# Altium schematic sheet NRF24L01P.SchDoc
size Tabloid
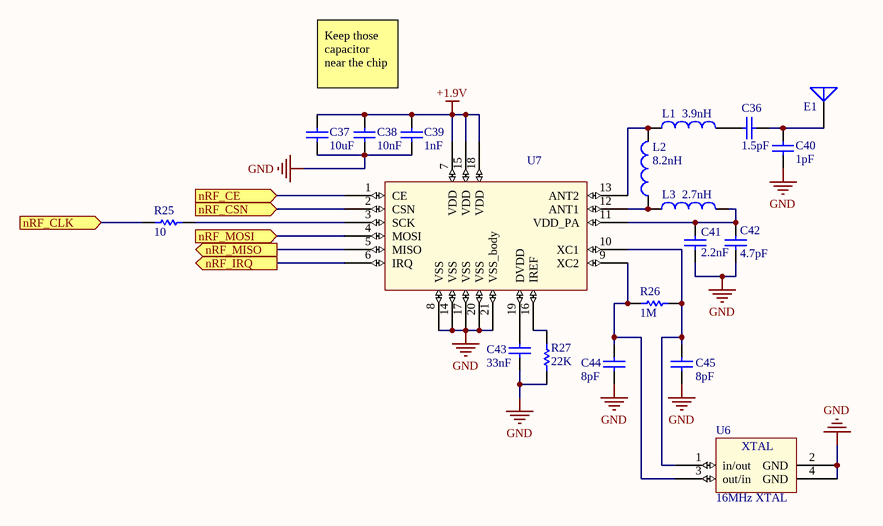
[diagram p0: NRF24L01P.SchDoc]

## Parts
C36  value 1.5pF  [0201_Custom]
C37  value 10uF  [0402]
C38  value 10nF  [0201_Custom]
C39  value 1nF  [0201_Custom]
C40  value 1pF  [0201_Custom]
C41  value 2.2nF  [0201_Custom]
C42  value 4.7pF  [0201_Custom]
C43  value 33nF  [0201_Custom]
C44  value 8pF  [0201_Custom]
C45  value 8pF  [0201_Custom]
E1  (no value)  [ANT-2.45-CHP-B]
L1  value 3.9nH  [0201_Custom]
L2  value 8.2nH  [0201_Custom]
L3  value 2.7nH  [0201_Custom]
R25  value 10  [0201_Custom]
R26  value 1M  [0201_Custom]
R27  value 22K  [0201_Custom]
U6  16MHz XTAL  [8Y-16.000MAAV-T]
U7  (no value)  [QFN50P400X400-20W5M]

## Ports
nRF_CE (in), nRF_CLK (in), nRF_CSN (in), nRF_IRQ (out), nRF_MISO (out), nRF_MOSI (in)

## Nets
+1.9V: C37.2 C38.2 C39.2 U7.7(VDD) U7.15(VDD) U7.18(VDD)
GND: C37.1 C38.1 C39.1 C40.2 C41.1 C42.1 C43.1 C44.1 C45.1 R27.1 U6.2(GND) U6.4(GND) U7.8(VSS) U7.14(VSS) U7.17(VSS) U7.20(VSS) U7.21(VSS_body)
nRF_CE: U7.1(CE) ; port nRF_CE
nRF_CLK: R25.2 ; port nRF_CLK
nRF_CSN: U7.2(CSN) ; port nRF_CSN
nRF_IRQ: U7.6(IRQ) ; port nRF_IRQ
nRF_MISO: U7.5(MISO) ; port nRF_MISO
nRF_MOSI: U7.4(MOSI) ; port nRF_MOSI
NetC36_1: C36.1 C40.1 E1.1(A)
NetC36_2: C36.2 L1.2
NetC41_2: C41.2 C42.2 L3.2 U7.11(VDD_PA)
NetC43_2: C43.2 U7.19(DVDD)
NetC44_2: C44.2 R26.2 U6.3(out/in) U7.9(XC2)
NetC45_2: C45.2 R26.1 U6.1(in/out) U7.10(XC1)
NetL1_1: L1.1 L2.2 U7.13(ANT2)
NetL2_1: L2.1 L3.1 U7.12(ANT1)
NetR25_1: R25.1 U7.3(SCK)
NetR27_2: R27.2 U7.16(IREF)

## Notes on the sheet
- Keep those capacitor near the chip
- (in symbol 8Y-16.000MAAV-T) XTAL

## Library data of the parts
C36-C45 = Cap Semi: Capacitor (Semiconductor SIM Model); Published: 8-Jun-2000; LatestRevisionDate: 29-May-2009; LatestRevisionNote: IPC-7351 Footprint Added.; PackageReference: C1206; Publisher: Altium Limited; PackageDescription: Chip Capacitor
E1 = Antenna: Generic Antenna; Published: 24-Mar-1999; LatestRevisionDate: 17-Jul-2002; LatestRevisionNote: Re-released for DXP Platform.; PackageReference: PIN1; Publisher: Altium Limited
L1-L3 = Inductor: Code_IEC: 1005; Published: 8-Jun-2000; LatestRevisionDate: 29-May-2009; LatestRevisionNote: IPC-7351 Footprint Added.; PackageReference: 0402-A; Publisher: Altium Limited; PackageDescription: Chip Inductor; Code_JEITA: 0402
R25-R27 = Res Semi: Semiconductor Resistor; Published: 8-Jun-2000; LatestRevisionDate: 17-Jul-2002; LatestRevisionNote: Re-released for DXP Platform.; PackageReference: AXIAL-0.5; Publisher: Altium Limited; PackageDescription: Axial Device, Thru-Hole; 2 Leads; 0.5 in Pin Spacing
U6 = 8Y-16.000MAAV-T: SMD 16 MHz XTAL
U7 = nRF24L01p: nRF24L01+